# EAGLE design 1TTR4--- Cumbo.Fabio --- PIC Double (EAGLE 7.7.0)
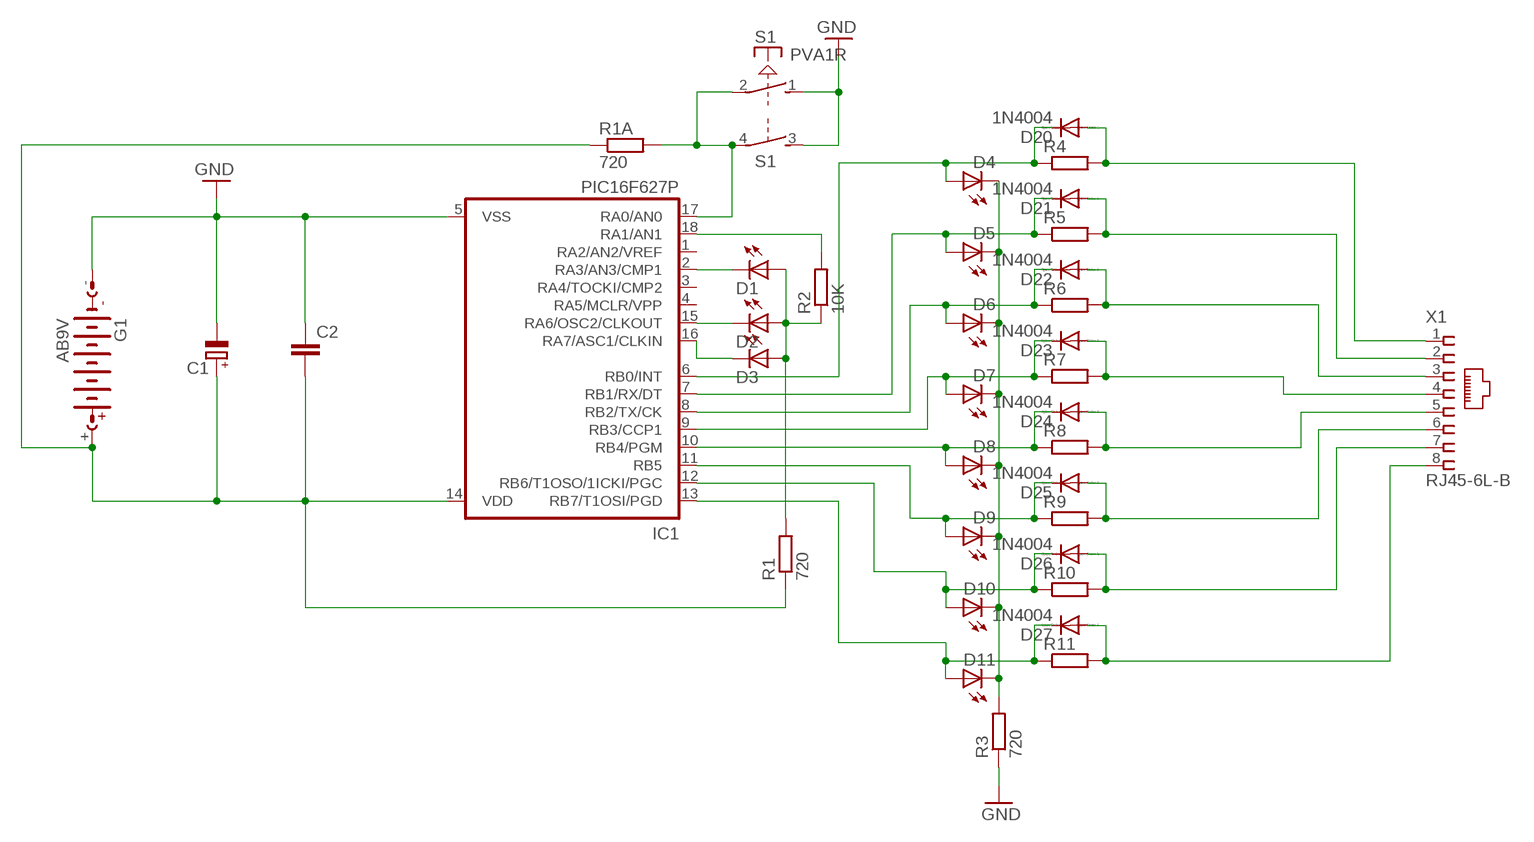
[diagram p0: schematic, sheet 1]

## Parts
C1  CPOL-EUE5-6  [E5-6]
C2  C-EU050-024X044  [C050-024X044]
D1  LED5MM  [LED5MM]
D2  LED5MM  [LED5MM]
D3  LED5MM  [LED5MM]
D4  LED5MM  [LED5MM]
D5  LED5MM  [LED5MM]
D6  LED5MM  [LED5MM]
D7  LED5MM  [LED5MM]
D8  LED5MM  [LED5MM]
D9  LED5MM  [LED5MM]
D10  LED5MM  [LED5MM]
D11  LED5MM  [LED5MM]
D20  1N4004  [DO41-10]
D21  1N4004  [DO41-10]
D22  1N4004  [DO41-10]
D23  1N4004  [DO41-10]
D24  1N4004  [DO41-10]
D25  1N4004  [DO41-10]
D26  1N4004  [DO41-10]
D27  1N4004  [DO41-10]
G1  AB9V  [AB9V]
IC1  PIC16F627P  [DIL18]
R1  720  R-EU_0204/7  [0204/7]
R1A  720  R-EU_0204/7  [0204/7]
R2  10K  R-EU_0204/7  [0204/7]
R3  720  R-EU_0204/7  [0204/7]
R4  R-EU_0204/7  [0204/7]
R5  R-EU_0204/7  [0204/7]
R6  R-EU_0204/7  [0204/7]
R7  R-EU_0204/7  [0204/7]
R8  R-EU_0204/7  [0204/7]
R9  R-EU_0204/7  [0204/7]
R10  R-EU_0204/7  [0204/7]
R11  R-EU_0204/7  [0204/7]
S1  PVA1R  [PVA1R]
X1  RJ45-6L-B  [RJ45-NO-SHIELD]

## Nets
GND: C1.- C2.1 G1.- IC1.5(VSS) R3.1 S1.1(1:S) S1.3(2:S)
N$1: D11.A D27.C IC1.13(RB7/T1OSI/PGD) R11.1
N$2: D27.A R11.2 X1.8
N$3: D10.A D26.C IC1.12(RB6/T1OSO/1ICKI/PGC) R10.1
N$4: D9.A D25.C IC1.11(RB5) R9.1
N$5: D24.A R8.2 X1.5
N$6: D23.A R7.2 X1.4
N$7: D22.A R6.2 X1.3
N$8: D21.A R5.2 X1.2
N$9: D20.A R4.2 X1.1
N$10: D1.K(C) IC1.2(RA3/AN3/CMP1)
N$11: D25.A R9.2 X1.6
N$12: D7.A D23.C IC1.9(RB3/CCP1) R7.1
N$13: D26.A R10.2 X1.7
N$14: D6.A D22.C IC1.8(RB2/TX/CK) R6.1
N$15: D5.A D21.C IC1.7(RB1/RX/DT) R5.1
N$16: D4.A D20.C IC1.6(RB0/INT) R4.1
N$17: D4.K(C) D5.K(C) D6.K(C) D7.K(C) D8.K(C) D9.K(C) D10.K(C) D11.K(C) R3.2
N$18: C1.+ C2.2 G1.+ IC1.14(VDD) R1.1 R1A.1
N$19: IC1.17(RA0/AN0) R1A.2 S1.2(1:P) S1.4(2:P)
N$21: D8.A D24.C IC1.10(RB4/PGM) R8.1
N$22: D3.K(C) IC1.16(RA7/ASC1/CLKIN)
N$23: D2.K(C) IC1.15(RA6/OSC2/CLKOUT)
N$25: IC1.18(RA1/AN1) R2.2
N$26: D1.A D2.A D3.A R1.2 R2.1
Unconnected: IC1.1(RA2/AN2/VREF) IC1.3(RA4/TOCKI/CMP2) IC1.4(RA5/MCLR/VPP)

## Library data of the parts
C1 = resistor:CPOL-EU: POLARIZED CAPACITOR, European symbol
C2 = resistor:C-EU: CAPACITOR, European symbol
D1-D11 = led:LED: LED OSRAM: - CHIPLED LG R971, LG N971, LY N971, LG Q971, LY Q971, LO R971, LY R971 LH N974, LH R974 LS Q976, LO Q976, LY Q976 LO Q996 - Hyper CHIPLED LW Q18S LB Q993, LB Q99A, LB R99A - SideLED LS A670, LO A670, LY A670, LG A670, LP A670 LB A673, LV A673, LT A673, LW A673 LH A674 LY A675 LS A676, LA A676, LO A676, LY A676, LW A676 LS A679, LY A679, LG A679 - Hyper Micro SIDELED® LS Y876, LA Y876, LO Y876, LY Y876 LT Y87S - SmartLED LW L88C, LW L88S LB L89C, LB L89S, LG L890 LS L89K, LO L89K, LY L89K LS L896, LA L896, LO L896, LY L896 - TOPLED LS T670, LO T670, LY T670, LG T670, LP T670 LSG T670, LSP T670, LSY T670, LOP T670, LYG T670 LG T671, LOG T671, LSG T671 LB T673, LV T673, LT T673, LW T673 LH T674 LS T676, LA T676, LO T676, LY T676, LB T676, LH T676, LSB T676, LW T676 LB T67C, LV T67C, LT T67C, LS T67K, LO T67K, LY T67K, LW E67C LS E67B, LA E67B, LO E67B, LY E67B, LB E67C, LV E67C, LT E67C LW T67C LS T679, LY T679, LG T679 LS T770, LO T770, LY T770, LG T770, LP T770 LB T773, LV T773, LT T773, LW T773 LH T774 LS E675, LA E675, LY E675, LS T675 LS T776, LA T776, LO T776, LY T776, LB T776 LHGB T686 LT T68C, LB T68C - Hyper Mini TOPLED® LB M676 - Mini TOPLED Santana® LG M470 LS M47K, LO M47K, LY M47K Source: http://www.osram.convergy.de LUXEON: - LUMILED® LXK2-PW12-R00, LXK2-PW12-S00, LXK2-PW14-U00, LXK2-PW14-V00 LXK2-PM12-R00, LXK2-PM12-S00, LXK2-PM14-U00 LXK2-PE12-Q00, LXK2-PE12-R00, LXK2-PE12-S00, LXK2-PE14-T00, LXK2-PE14-U00 LXK2-PB12-K00, LXK2-PB12-L00, LXK2-PB12-M00, LXK2-PB14-N00, LXK2-PB14-P00, LXK2-PB14-Q00 LXK2-PR12-L00, LXK2-PR12-M00, LXK2-PR14-Q00, LXK2-PR14-R00 LXK2-PD12-Q00, LXK2-PD12-R00, LXK2-PD12-S00 LXK2-PH12-R00, LXK2-PH12-S00 LXK2-PL12-P00, LXK2-PL12-Q00, LXK2-PL12-R00 Source: www.luxeon.com KINGBRIGHT: KA-3528ASYC Source: www.kingbright.com
D20-D27 = diode:1N4004: DIODE general purpose rectifier, 1 A
G1 = battery:AB9V: 9-V BATTERY CLIP
IC1 = microchip:PIC16*F62: FLASH-Based 8-Bit CMOS Microcontroller Source: http://ww1.microchip.com/downloads/en/DeviceDoc/40300C.pdf; MF: MICROCHIP; MPN: PIC16F627-20I/P; OC_FARNELL: 1084298; OC_NEWARK: 23C4967
R1 R1A R2-R11 = resistor:R-EU_: RESISTOR, European symbol
S1 = switch-misc:PVA1R: ITT SWITCH
X1 = con-tycoelectronics:RJ45: CORCOM Modular RJ Jacks No Shield Source: www.tycoelectronics.com .. ENG_DS_1654001_1099_RJ_L_0507.pdf; MPN: RJ45-6L-B; OC_FARNELL: unknown; OC_NEWARK: 16R6090

## Net classes
0 default: width 2 mm, drill 0.8 mm, clearance 0.2 mm

## Board
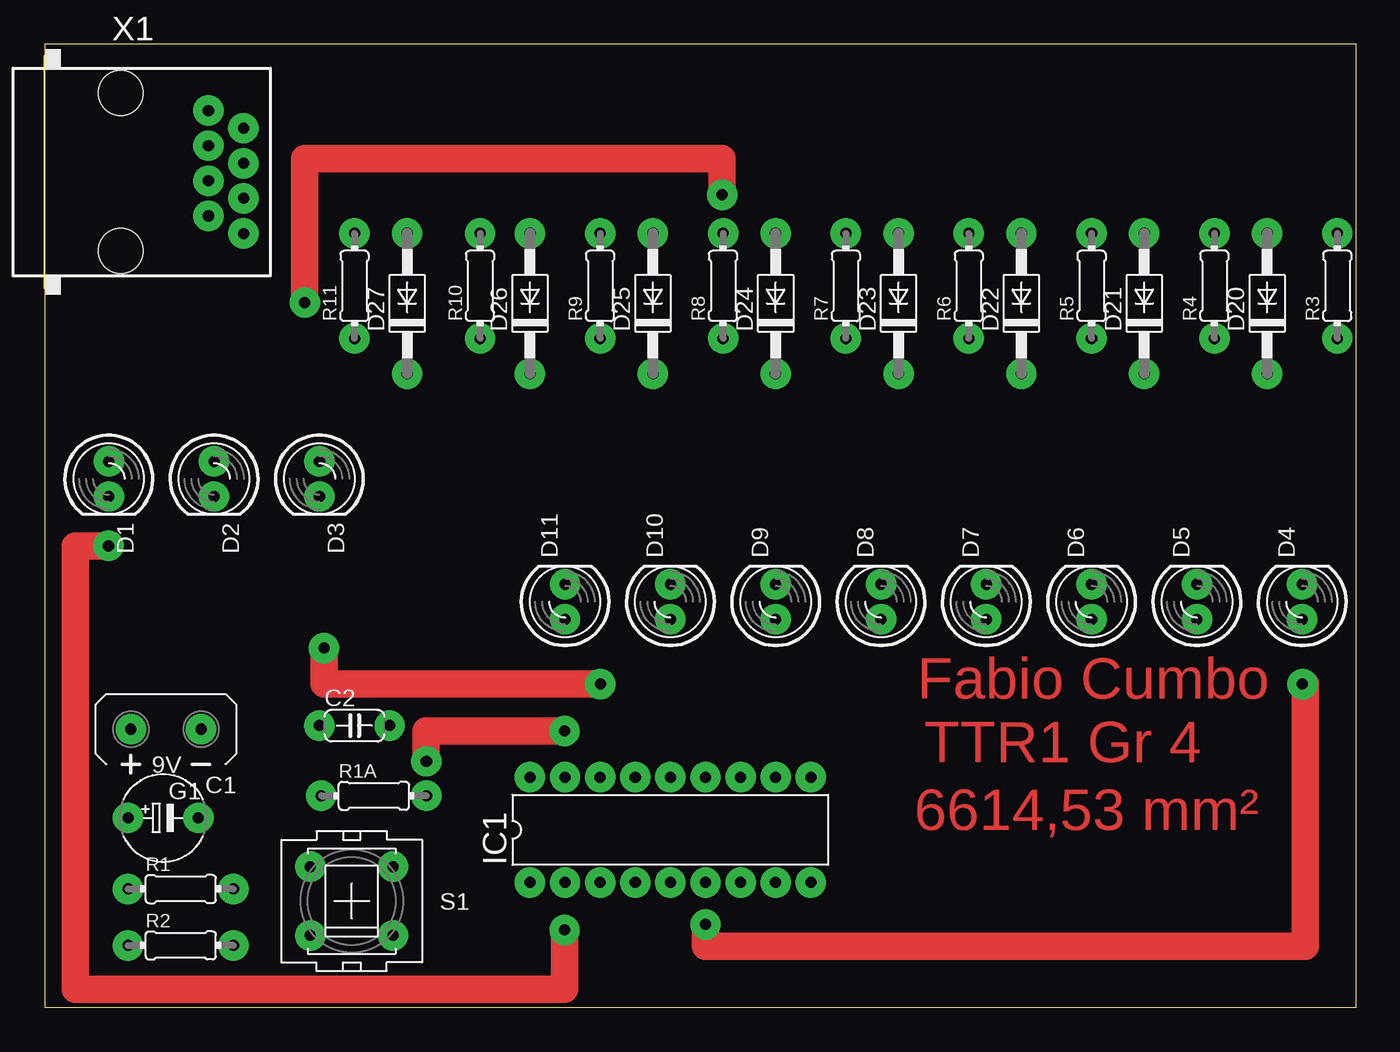
[diagram p1: board, top side]
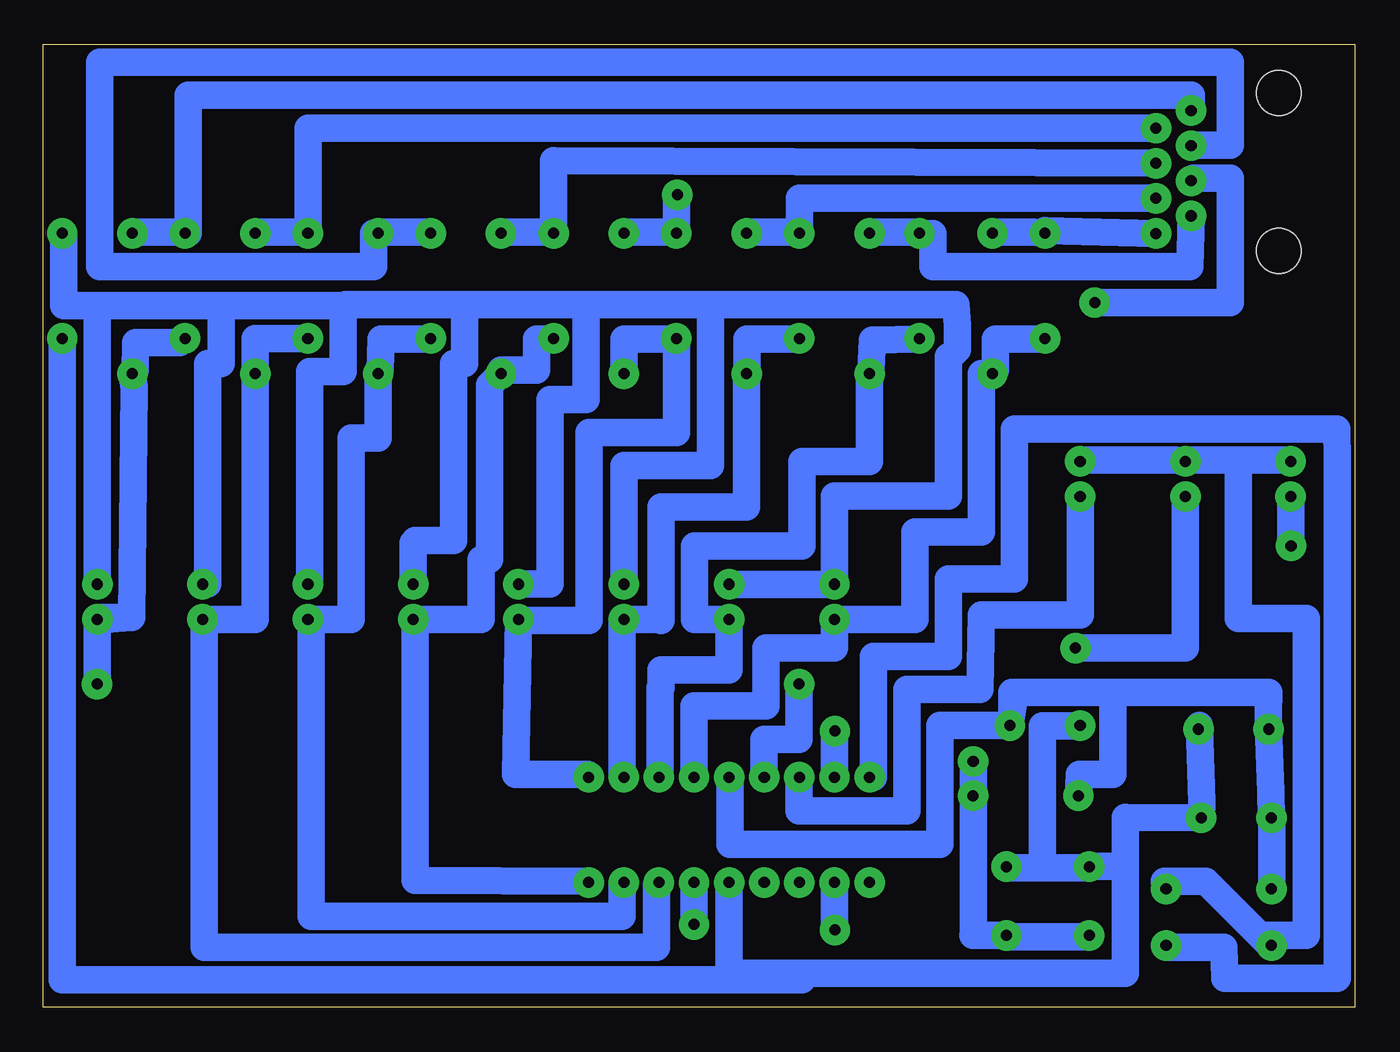
[diagram p2: board, bottom side, seen from below]

Size 94.93 x 69.7 mm. Coordinates in mm from the lower left corner, seen from the top.
Outline: 0.03,0 94.93,0 94.93,69.7 0.03,69.7 0.03,0
Copper layers (1*16): Top 0.035mm / dielectric 1.5mm / Bottom 0.035mm
Design rules "default": minimum track width 10mil, minimum drill 24mil, track to track 8mil, track to pad 8mil, pad to pad 8mil, via to via 8mil, smd to smd 8mil, copper to edge 40mil, drill to drill 8mil, minimum pad ring 10mil, minimum via ring 8mil, stop-mask expansion 4mil, vias tented up to drill 0mil, thermal gap 10mil

### Footprints (pad centres in the part's own frame; a part is rotated, then mirrored left to right if it is on the bottom)
E5-6 = drill 0.8 pad 2.2: + -2.54,0; - 2.54,0
C050-024X044 = drill 0.8 pad 2.2: 1 -2.54,0; 2 2.54,0
LED5MM = drill 0.8 pad 2.2: A -1.27,0; K 1.27,0
DO41-10 = drill 0.8 pad 2.2: A 5.08,0; C -5.08,0
AB9V = drill 0.8 pad 2.2: + 0,2.54; - 0,-2.54
DIL18 = drill 0.8 pad 2.2: 1 -10.16,-3.81; 2 -7.62,-3.81; 3 -5.08,-3.81; 4 -2.54,-3.81; 5 0,-3.81; 6 2.54,-3.81; 7 5.08,-3.81; 8 7.62,-3.81; 9 10.16,-3.81; 10 10.16,3.81; 11 7.62,3.81; 12 5.08,3.81; 13 2.54,3.81; 14 0,3.81; 15 -2.54,3.81; 16 -5.08,3.81; 17 -7.62,3.81; 18 -10.16,3.81
0204/7 = drill 0.8 pad 2.2: 1 -3.81,0; 2 3.81,0
PVA1R = drill 0.8 pad 2.2: 1 -2.997,2.489; 2 -2.997,-2.489; 3 2.997,2.489; 4 2.997,-2.489
RJ45-NO-SHIELD = drill 0.8 pad 2.2: 1 -4.445,6.35; 2 -3.175,8.89; 3 -1.905,6.35; 4 -0.635,8.89; 5 0.635,6.35; 6 1.905,8.89; 7 3.175,6.35; 8 4.445,8.89 | hole 3.251: -5.715,0; 5.715,0

### Placement (x,y rotation side)
C1  8.59,13.71 0 top
C2  22.43,20.39 0 top
D1  4.65,38.24 270 top
D2  12.27,38.24 270 top
D3  19.89,38.24 270 top
D4  91.01,29.35 90 top
D5  83.39,29.35 90 top
D6  75.77,29.35 90 top
D7  68.15,29.35 90 top
D8  60.53,29.35 90 top
D9  52.91,29.35 90 top
D10  45.29,29.35 90 top
D11  37.67,29.35 90 top
D20  88.47,50.94 90 top
D21  79.58,50.94 90 top
D22  70.69,50.94 90 top
D23  61.8,50.94 90 top
D24  52.91,50.94 90 top
D25  44.02,50.94 90 top
D26  35.13,50.94 90 top
D27  26.24,50.94 90 top
G1  8.79,20.13 90 top
IC1  45.29,12.84 0 top
R1  [0204/7]  9.86,8.56 0 top
R1A  [0204/7]  23.83,15.31 0 top
R2  [0204/7]  9.86,4.48 0 top
R3  93.55,52.21 90 top
R4  84.66,52.21 90 top
R5  75.77,52.21 90 top
R6  66.88,52.21 90 top
R7  57.99,52.21 90 top
R8  49.1,52.21 90 top
R9  40.21,52.21 90 top
R10  31.52,52.21 90 top
R11  22.43,52.21 90 top
S1  22.23,7.69 0 top
X1  5.51,60.45 270 top

### Tracks (layer width: path | path; a pad name or v marks a point on that pad's centre or on a via)
GND
  Bottom 2: G1.- 11.28,20.4 11.08,14.85 C1.- 16.63,13.75 16.63,10.2 | 22.63,10.1 25.28,10.1 S1.3 | 22.63,10.1 19.53,10.1 S1.1 19.43,10.2 16.63,10.2 | 22.63,10.1 22.63,20.35 20.03,20.35 C2.1 | 93.53,48.35 R3.1 93.55,2 40.03,2 40.03,2.45 | 45.23,9.03 IC1.5 45.29,2.45 40.03,2.45 | 16.63,10.2 16.63,2.45 40.03,2.45
N$1
  Bottom 2: R11.1 22.53,48.35 26.03,48.35 26.03,46.1 D27.C 27.03,45.86 27.03,34.4 31.83,34.4 31.83,28.08 D11.A 37.67,26 42.63,26 42.63,21.8 47.83,21.8 IC1.13
N$2
  Bottom 2: D27.A 26.03,56.1 23.28,56.1 R11.2 22.43,56.2 X1.8
N$3
  Bottom 2: R10.1 31.53,48.35 34.93,48.3 35.03,46.1 D26.C 35.13,39.5 40.03,39.5 40.03,33.4 47.78,33.4 47.78,28.08 D10.A 45.29,24.4 50.23,24.4 50.23,23.1 50.28,23.1 50.28,16.85 IC1.12
N$4
  Bottom 2: R9.1 40.28,48.35 43.98,48.35 43.98,45.9 D25.C 44.02,36.2 50.23,36.2 50.23,28.08 | IC1.11 53.03,16.85 53.03,27.85 D9.A 50.23,28.08 | 50.23,28.08 50.23,28
N$5  (via drill 0.8 pad 2.2)
  Top 2: v18.83,51 18.83,61.4 49.03,61.4 v49.03,58.8
  Bottom 2: D24.A 52.78,56.1 49.28,56.1 R8.2 49.1,58.8 v49.03,58.8 | v18.83,51 9.03,51 9.03,60 11.66,60 X1.5
N$6
  Bottom 2: D23.A 61.78,56.1 58.03,56.1 R7.2 57.99,61.29 X1.4
N$7
  Bottom 2: R6.2 67.03,56.1 70.53,56.1 D22.A 71.03,56.02 71.03,53.6 90.83,53.6 90.83,68.4 9.03,68.4 9.03,62.4 11.66,62.4 X1.3
N$8
  Bottom 2: D21.A 79.53,56.1 75.78,56.1 R5.2 75.77,63.63 X1.2
N$9
  Bottom 2: D20.A 88.28,56.1 84.78,56.1 R4.2 84.43,56.02 84.43,66 11.86,66 X1.1
N$10  (via drill 0.8 pad 2.2)
  Top 2: v4.63,33.4 2.23,33.4 2.23,1.3 37.63,1.3 v37.63,5.6
  Bottom 2: D1.K 4.63,36.97 v4.63,33.4 | v37.63,5.6 37.67,5.6 IC1.2
N$11
  Bottom 2: D25.A 43.78,56.1 40.28,56.1 R9.2 40.21,58.55 X1.6
N$12
  Bottom 2: R7.1 58.03,48.35 59.23,48.35 59.23,46.1 61.78,46.1 D23.C 62.63,45.03 62.63,32.4 63.23,32.4 63.23,28.08 D7.A 68.03,27.85 68.03,9.2 55.53,9.1 IC1.9
N$13
  Bottom 2: D26.A 35.03,56.1 31.53,56.1 R10.2 30.53,56 30.53,53.6 11.96,53.6 X1.7
N$14
  Bottom 2: R6.1 67.03,48.35 70.48,48.35 70.53,46.1 D22.C 70.69,41.2 72.63,41.2 72.63,28.08 D6.A 75.53,27.85 75.53,6.6 53.03,6.6 53.03,8.85 IC1.8
N$15
  Bottom 2: IC1.7 50.53,8.85 50.53,4.35 83.28,4.35 83.28,27.85 D5.A 79.58,28.08 D21.C 79.58,48.4 R5.1
N$16  (via drill 0.8 pad 2.2)
  Top 2: v91.03,23.4 91.23,23.4 91.23,4.4 47.83,4.4 v47.83,6
  Bottom 2: R4.1 84.78,48.35 85.03,48.1 88.23,48.1 88.28,46.1 D20.C 88.33,44.85 88.53,28.2 | 88.53,28.2 90.03,28.1 D4.A | 88.53,28.2 91.03,28.2 v91.03,23.4 | v47.83,6 IC1.6
N$17
  Bottom 2: D10.K 45.28,30.6 37.78,30.6 D11.K 37.67,37 29.43,37 29.43,47.1 29.28,47.1 29.21,47.18 | 29.21,47.18 28.78,47.6 28.78,49.35 28.88,50.85 46.63,50.85 | 29.23,47.18 29.21,47.18 | 52.83,30.62 D9.K 52.91,39.2 46.63,39.2 46.63,50.85 | 55.63,50.85 55.63,44 58.23,44 58.23,30.62 D8.K | D7.K 68.15,33.6 68.03,33.6 68.03,33.8 65.23,33.8 65.23,46.6 64.43,46.6 64.43,50.85 | D6.K 75.63,30.62 75.63,46 73.23,46 73.23,50.8 | 55.63,50.85 64.43,50.85 | 64.43,50.85 73.03,50.85 73.23,50.8 | 46.63,50.85 55.63,50.85 | R3.2 93.43,56.02 93.43,50.8 91.03,50.8 | 91.03,50.8 82.03,50.8 | 82.03,50.8 73.23,50.8 | D4.K 91.03,30.62 91.03,50.8 | D5.K 83.03,30.62 83.03,46.6 82.03,46.6 82.03,50.8
N$18
  Bottom 2: R1.1 6.03,9.35 6.03,13.6 C1.+ 6.08,15.6 6.28,20.4 | 6.28,20.4 G1.+ | R1A.1 19.93,16.85 17.53,16.85 17.53,22.8 | IC1.14 45.23,16.65 45.23,11.8 30.03,11.8 30.03,20.4 C2.2 24.77,21.8 24.83,21.8 24.83,22.8 17.53,22.8 | 6.28,20.4 6.28,22.2 6.23,22.2 6.23,22.8 17.53,22.8
N$19  (via drill 0.8 pad 2.2)
  Top 2: v27.63,17.8 27.63,20 v37.63,20
  Bottom 2: S1.2 19.53,5.1 25.28,5.1 S1.4 27.63,5.2 | 27.63,5.2 27.64,5.2 | v27.63,17.8 27.63,15.71 R1A.2 27.63,5.2 | v37.63,20 37.67,19.6 IC1.17
N$21
  Bottom 2: IC1.10 55.53,16.85 60.73,16.85 D8.A 60.53,28 55.43,28 55.43,41.6 49.1,41.6 R8.1 49.28,48.35 52.91,48.35 D24.C
N$22
  Bottom 2: IC1.16 40.23,16.65 40.23,14.2 32.43,14.2 32.43,23 27.13,23 27.03,28.4 19.89,28.4 D3.K
N$23  (via drill 0.8 pad 2.2)
  Top 2: v20.23,26 20.23,23.4 v40.23,23.4
  Bottom 2: D2.K 12.27,26 v20.23,26 | v40.23,23.4 40.23,19.4 42.75,19.4 IC1.15
N$25
  Bottom 2: R2.2 13.53,4.35 9.48,4.35 9.43,2.1 1.28,2.1 1.28,39.6 1.33,41.85 24.63,41.85 24.63,31 29.43,31 29.43,25.4 34.83,25.4 34.83,16.65 IC1.18
N$26
  Bottom 2: 6.91,5.22 10.78,9.1 13.78,9.1 R1.2 | 6.91,5.22 6.28,4.6 R2.1 | 8.43,39.6 12.03,39.6 D2.A 13.03,39.6 19.78,39.6 D3.A | 8.43,39.6 4.78,39.6 D1.A | 6.91,5.22 3.53,5.2 3.53,28.15 8.43,28.15 8.43,39.6

### Text on the board
Top: Fabio Cumbo | TTR1 Gr 4 | 6614,53 mm²